# EAGLE design M127X (EAGLE 4.11)
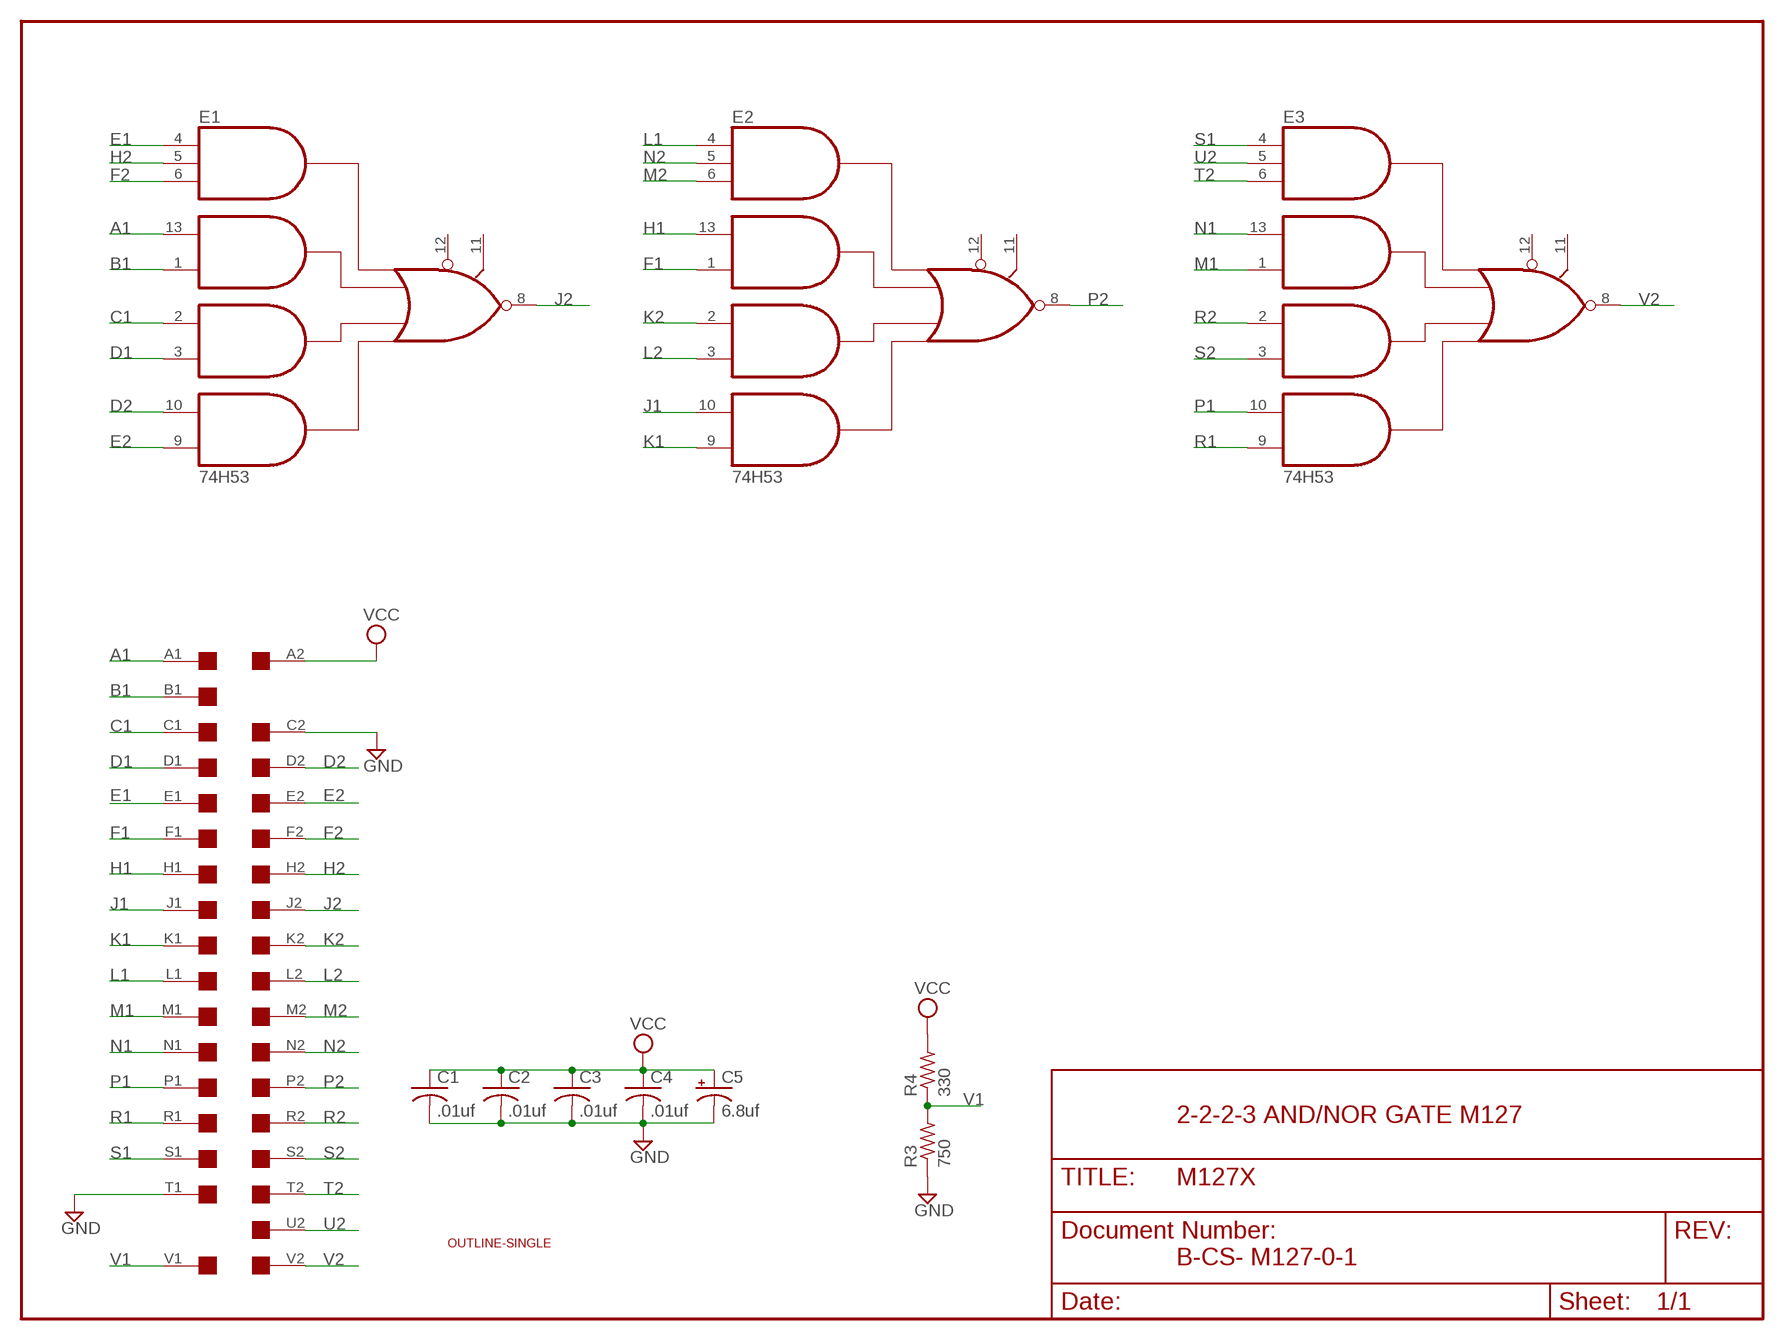
[diagram p0: schematic, sheet 1]

## Parts
C1  .01uf  C-US050-025X075  [C050-025X075]
C2  .01uf  C-US050-025X075  [C050-025X075]
C3  .01uf  C-US050-025X075  [C050-025X075]
C4  .01uf  C-US050-025X075  [C050-025X075]
C5  6.8uf  CPOL-USE15-5AXIAL  [E15-5]
E1  74H53  [DIL14]
E2  74H53  [DIL14]
E3  74H53  [DIL14]
R3  750  R-US_0207/10  [0207/10]
R4  330  R-US_0207/10  [0207/10]
U$1  OUTLINE-SINGLE  [SINGLE]
U$4  SINGLE  [EDGE-CON2]

## Nets
A1: E1.13(I3) U$4.A1
B1: E1.1(I4) U$4.B1
C1: E1.2(I5) U$4.C1
D1: E1.3(I6) U$4.D1
D2: E1.10(I7) U$4.D2
E1: E1.4(I1) U$4.E1
E2: E1.9(I8) U$4.E2
F1: E2.1(I4) U$4.F1
F2: E1.6(I2) U$4.F2
GND [Supply]: C1.2 C2.2 C3.2 C4.2 C5.- R3.1 U$4.C2 U$4.T1
H1: E2.13(I3) U$4.H1
H2: E1.5(I11) U$4.H2
J1: E2.10(I7) U$4.J1
J2: E1.8(O) U$4.J2
K1: E2.9(I8) U$4.K1
K2: E2.2(I5) U$4.K2
L1: E2.4(I1) U$4.L1
L2: E2.3(I6) U$4.L2
M1: E3.1(I4) U$4.M1
M2: E2.6(I2) U$4.M2
N1: E3.13(I3) U$4.N1
N2: E2.5(I11) U$4.N2
P1: E3.10(I7) U$4.P1
P2: E2.8(O) U$4.P2
R1: E3.9(I8) U$4.R1
R2: E3.2(I5) U$4.R2
S1: E3.4(I1) U$4.S1
S2: E3.3(I6) U$4.S2
T2: E3.6(I2) U$4.T2
U2: E3.5(I11) U$4.U2
V1: R3.2 R4.1 U$4.V1
V2: E3.8(O) U$4.V2
VCC [Supply]: C1.1 C2.1 C3.1 C4.1 C5.+ R4.2 U$4.A2
Unconnected: E1.11(I10) E1.12(I9) E2.11(I10) E2.12(I9) E3.11(I10) E3.12(I9) U$4.B2 U$4.U1

## Notes on the sheet
- 2-2-2-3 AND/NOR GATE M127
- B-CS- M127-0-1

## Power pins joined to a net without a drawn wire
GND: E1.7(GND) E2.7(GND) E3.7(GND)
VCC: E1.14(VCC) E2.14(VCC) E3.14(VCC)

## Library data of the parts
C1-C4 = rcl:C-US: CAPACITOR, American symbol
C5 = rcl:CPOL-US: POLARIZED CAPACITOR, American symbol
E1-E3 = 74xxN:74H53: 2-2-2-3 Input And-Or-Invert Gate
R3 R4 = rcl:R-US_: RESISTOR, American symbol
U$1 = dec-con:OUTLINE-*: Board outlines for DEC boards.
U$4 = dec-con:SINGLE: Single-Height DEC board

## Net classes
1 Supply: width 0.813 mm

## Board
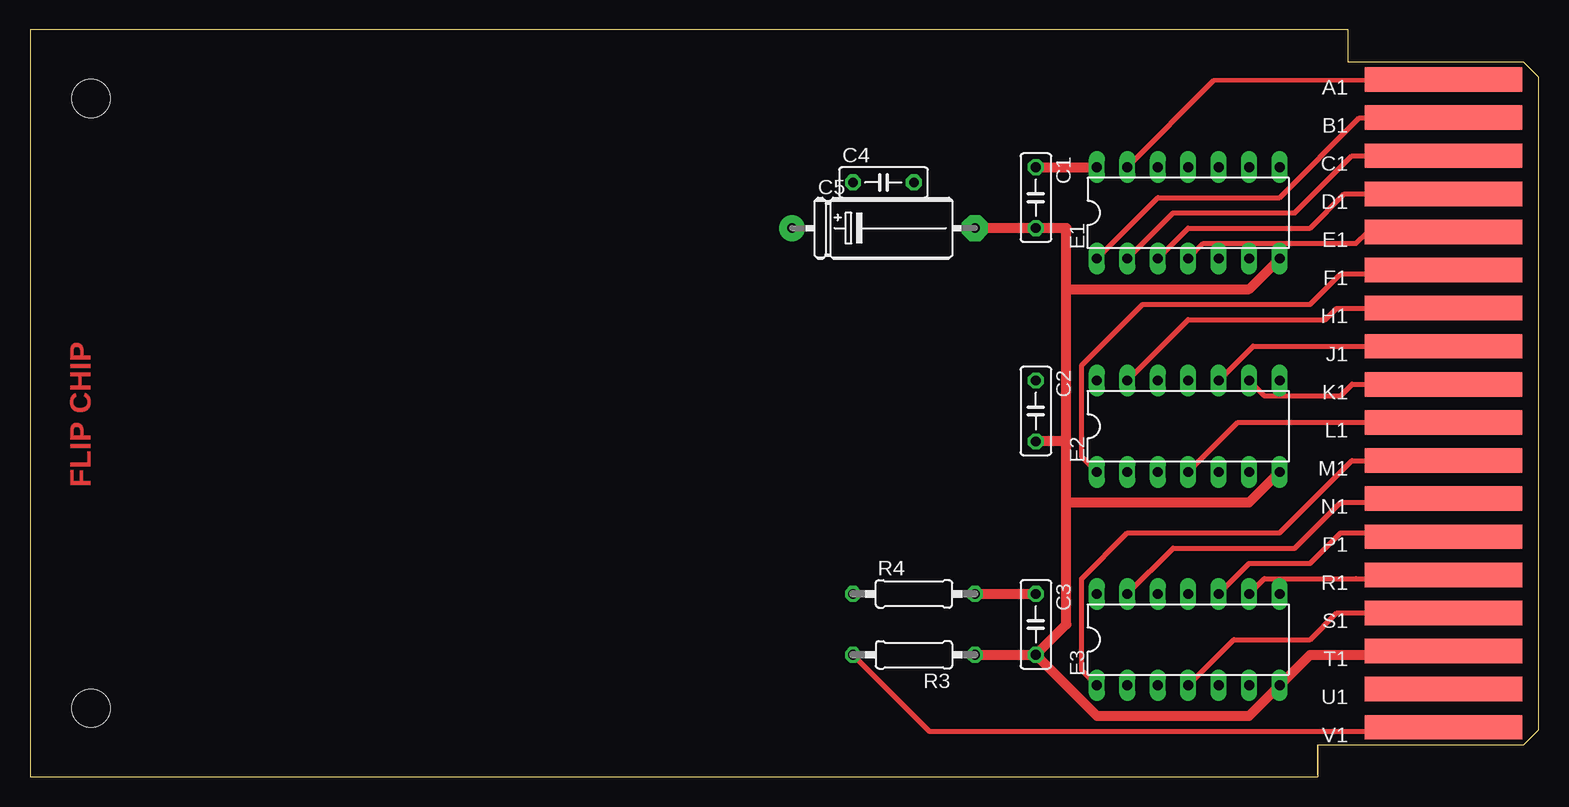
[diagram p1: board, top side]
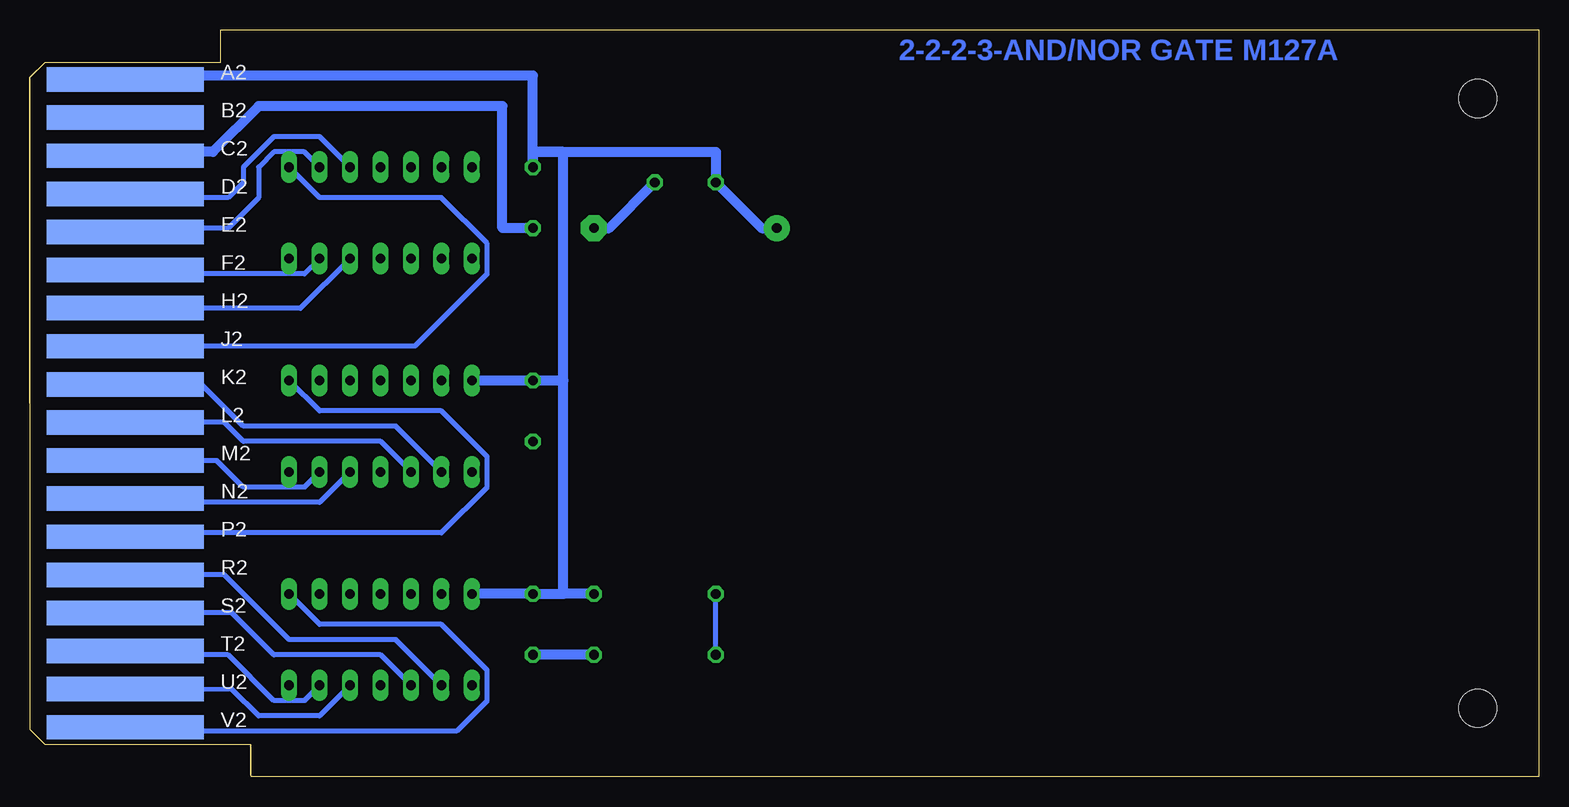
[diagram p2: board, bottom side, seen from below]

Size 125.73 x 62.23 mm. Coordinates in mm from the lower left corner, seen from the top.
Copper layers (1+16): Top 0.035mm / dielectric 1.5mm / Bottom 0.035mm
Design rules "16mils": minimum track width 16mil, minimum drill 32mil, track to track 15mil, track to pad 10mil, pad to pad 10mil, via to via 10mil, smd to smd 10mil, copper to edge 13mil, drill to drill 10mil, minimum pad ring 10mil, minimum via ring 8mil, stop-mask expansion 0mil, vias tented up to drill 0mil, thermal gap 10mil

### Footprints (pad centres in the part's own frame; a part is rotated, then mirrored left to right if it is on the bottom)
C050-025X075 = drill 0.813 octagon: 1 -2.54,0; 2 2.54,0
E15-5 = drill 0.813 pad 2.159: + -7.62,0 | drill 0.813 pad 2.159 octagon: - 7.62,0
DIL14 = drill 0.813 long: 1 -7.62,-3.81; 2 -5.08,-3.81; 3 -2.54,-3.81; 4 0,-3.81; 5 2.54,-3.81; 6 5.08,-3.81; 7 7.62,-3.81; 8 7.62,3.81; 9 5.08,3.81; 10 2.54,3.81; 11 0,3.81; 12 -2.54,3.81; 13 -5.08,3.81; 14 -7.62,3.81
0207/10 = drill 0.813 octagon: 1 -5.08,0; 2 5.08,0
SINGLE = hole 3.175: 120.65,56.515; 120.65,5.715
EDGE-CON2 = smd 13.106 x 2.032: A1 7.938,4.128; B1 7.938,7.303; C1 7.938,10.477; D1 7.938,13.652; E1 7.938,16.828; F1 7.938,20.003; H1 7.938,23.177; J1 7.938,26.352; K1 7.938,29.527; L1 7.938,32.703; M1 7.938,35.877; N1 7.938,39.053; P1 7.938,42.227; R1 7.938,45.403; S1 7.938,48.578; T1 7.938,51.752; U1 7.938,54.928; V1 7.938,58.102 | smd 13.106 x 2.032 bottom: A2 7.938,4.128; B2 7.938,7.303; C2 7.938,10.477; D2 7.938,13.652; E2 7.938,16.828; F2 7.938,20.003; H2 7.938,23.177; J2 7.938,26.352; K2 7.938,29.527; L2 7.938,32.703; M2 7.938,35.877; N2 7.938,39.053; P2 7.938,42.227; R2 7.938,45.403; S2 7.938,48.578; T2 7.938,51.752; U2 7.938,54.928; V2 7.938,58.102

### Placement (x,y rotation side)
C1  83.82,48.26 270 top
C2  83.82,30.48 270 top
C3  83.82,12.7 270 top
C4  71.12,49.53 0 top
C5  71.12,45.72 0 top
E1  96.52,46.99 0 top
E2  96.52,29.21 0 top
E3  96.52,11.43 0 top
R3  73.66,10.16 180 top
R4  73.66,15.24 0 top
U$1  125.73,62.23 180 top
U$4  125.73,62.23 180 top

### Tracks (layer width: path | path; a pad name or v marks a point on that pad's centre or on a via)
A1
  Top 0.406: U$4.A1 98.66,58.02 E1.13
B1
  Top 0.406: U$4.B1 110.78,54.9 104.14,48.26 93.98,48.26 E1.1
C1
  Top 0.406: U$4.C1 110.16,51.74 105.41,46.99 95.25,46.99 E1.2
D1
  Top 0.406: U$4.D1 109.53,48.56 106.68,45.72 96.52,45.72 E1.3
D2
  Bottom 0.406: U$4.D2 112.06,48.56 111.76,48.26 109.22,48.26 107.95,49.53 107.95,50.8 105.41,53.34 101.6,53.34 E1.10
E1
  Top 0.406: U$4.E1 111.43,45.39 110.49,44.45 97.79,44.45 E1.4
E2
  Bottom 0.406: E1.9 102.87,52.07 105.41,52.07 106.68,50.8 106.68,48.26 109.22,45.72 111.76,45.72 112.09,45.39 U$4.E2
F1
  Top 0.406: U$4.F1 111.76,41.91 109.22,41.91 106.68,39.37 92.71,39.37 87.63,34.29 87.63,26.67 E2.1
F2
  Bottom 0.406: U$4.F2 112.04,42.19 111.76,41.91 102.87,41.91 E1.6
GND
  Top 0.813: U$4.T1 112.09,10.49 111.76,10.16 106.68,10.16 E3.7 101.6,5.08 88.9,5.08 C3.2 | E1.7 101.6,40.64 86.36,40.64 | 86.36,40.64 86.36,45.72 C1.2 C5.- | E2.7 101.6,22.86 86.36,22.86 | 86.36,22.86 86.36,27.94 | 86.36,27.94 86.36,40.64 | C3.2 86.36,12.7 86.36,22.86 | R3.1 C3.2 | 86.36,27.94 C2.2
  Bottom 0.813: U$4.C2 112.09,51.74 111.76,52.07 110.49,52.07 106.68,55.88 86.36,55.88 86.36,45.72 C1.2 | C5.- 77.47,45.72 C4.2 | R3.1 C3.2
H1
  Top 0.406: U$4.H1 108.89,39.04 107.95,38.1 96.52,38.1 E2.13
H2
  Bottom 0.406: U$4.H2 103.2,39.04 E1.5
J1
  Top 0.406: U$4.J1 101.93,35.89 E2.10
J2
  Bottom 0.406: U$4.J2 93.65,35.89 87.63,41.91 87.63,44.45 91.44,48.26 101.6,48.26 E1.8
K1
  Top 0.406: U$4.K1 110.19,32.72 109.22,31.75 102.87,31.75 E2.9
K2
  Bottom 0.406: U$4.K2 111.45,32.72 107.95,29.21 95.25,29.21 E2.2
L1
  Top 0.406: U$4.L1 100.66,29.54 E2.4
L2
  Bottom 0.406: E2.3 96.52,27.94 107.95,27.94 | 107.95,27.94 109.22,29.21 | U$4.L2 109.55,29.54 107.95,27.94
M1
  Top 0.406: U$4.M1 110.16,26.34 104.14,20.32 91.44,20.32 87.63,16.51 87.63,8.89 E3.1
M2
  Bottom 0.406: U$4.M2 110.16,26.34 107.95,24.13 102.87,24.13 E2.6
N1
  Top 0.406: U$4.N1 112.09,23.19 111.76,22.86 109.22,22.86 105.41,19.05 95.25,19.05 E3.13
N2
  Bottom 0.406: U$4.N2 112.09,23.19 111.76,22.86 101.6,22.86 E2.5
P1
  Top 0.406: U$4.P1 112.09,19.99 111.76,20.32 109.22,20.32 106.68,17.78 101.6,17.78 E3.10
P2
  Bottom 0.406: E2.8 101.6,30.48 91.44,30.48 87.63,26.67 87.63,24.13 91.44,20.32 111.76,20.32 112.09,19.99 U$4.P2
R1
  Top 0.406: U$4.R1 111.76,16.51 110.49,16.51 102.87,16.51 E3.9
R2
  Bottom 0.406: E3.2 95.25,11.43 104.14,11.43 109.55,16.84 U$4.R2
S1
  Top 0.406: U$4.S1 108.92,13.66 106.68,11.43 100.33,11.43 E3.4
S2
  Bottom 0.406: U$4.S2 108.92,13.66 105.41,10.16 96.52,10.16 E3.3
T2
  Bottom 0.406: U$4.T2 112.09,10.49 111.76,10.16 109.22,10.16 105.41,6.35 102.87,6.35 E3.6
U2
  Bottom 0.406: U$4.U2 108.86,7.26 106.68,5.08 101.6,5.08 E3.5
V1
  Top 0.406: U$4.V1 112.15,4.2 111.76,3.81 74.93,3.81 74.54,4.2 R3.2
  Bottom 0.406: R3.2 R4.1
V2
  Bottom 0.406: E3.8 101.6,12.7 91.44,12.7 87.63,8.89 87.63,6.35 90.17,3.81 111.76,3.81 112.15,4.2 U$4.V2
VCC
  Top 0.813: C1.1 E1.14 | R4.2 C3.1
  Bottom 0.813: U$4.A2 113.43,58.02 113.03,58.42 83.82,58.42 C1.1 83.82,52.07 | C5.+ 64.77,45.72 C4.1 68.58,52.07 83.82,52.07 | R4.2 81.28,15.24 | 81.28,15.24 C3.1 E3.14 | E2.14 C2.1 81.28,33.02 | 81.28,15.24 81.28,33.02 | 81.28,33.02 81.28,52.07 83.82,52.07

### Text on the board
Top: FLIP CHIP
Bottom: 2-2-2-3-AND/NOR GATE M127A